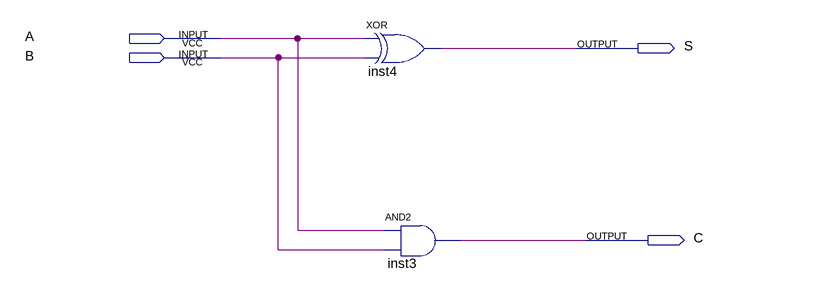
[diagram p0: schematic sheet]
// Quartus schematic fulladder.bdf as structural Verilog: 2 symbols, 4 pins
module fulladder (
  input  A,
  input  B,
  output S,
  output C
);

  xor inst4 (S, A, B);
  and inst3 (C, A, B);
endmodule
